# EAGLE schematic RotaryController (EAGLE 7.5.0)
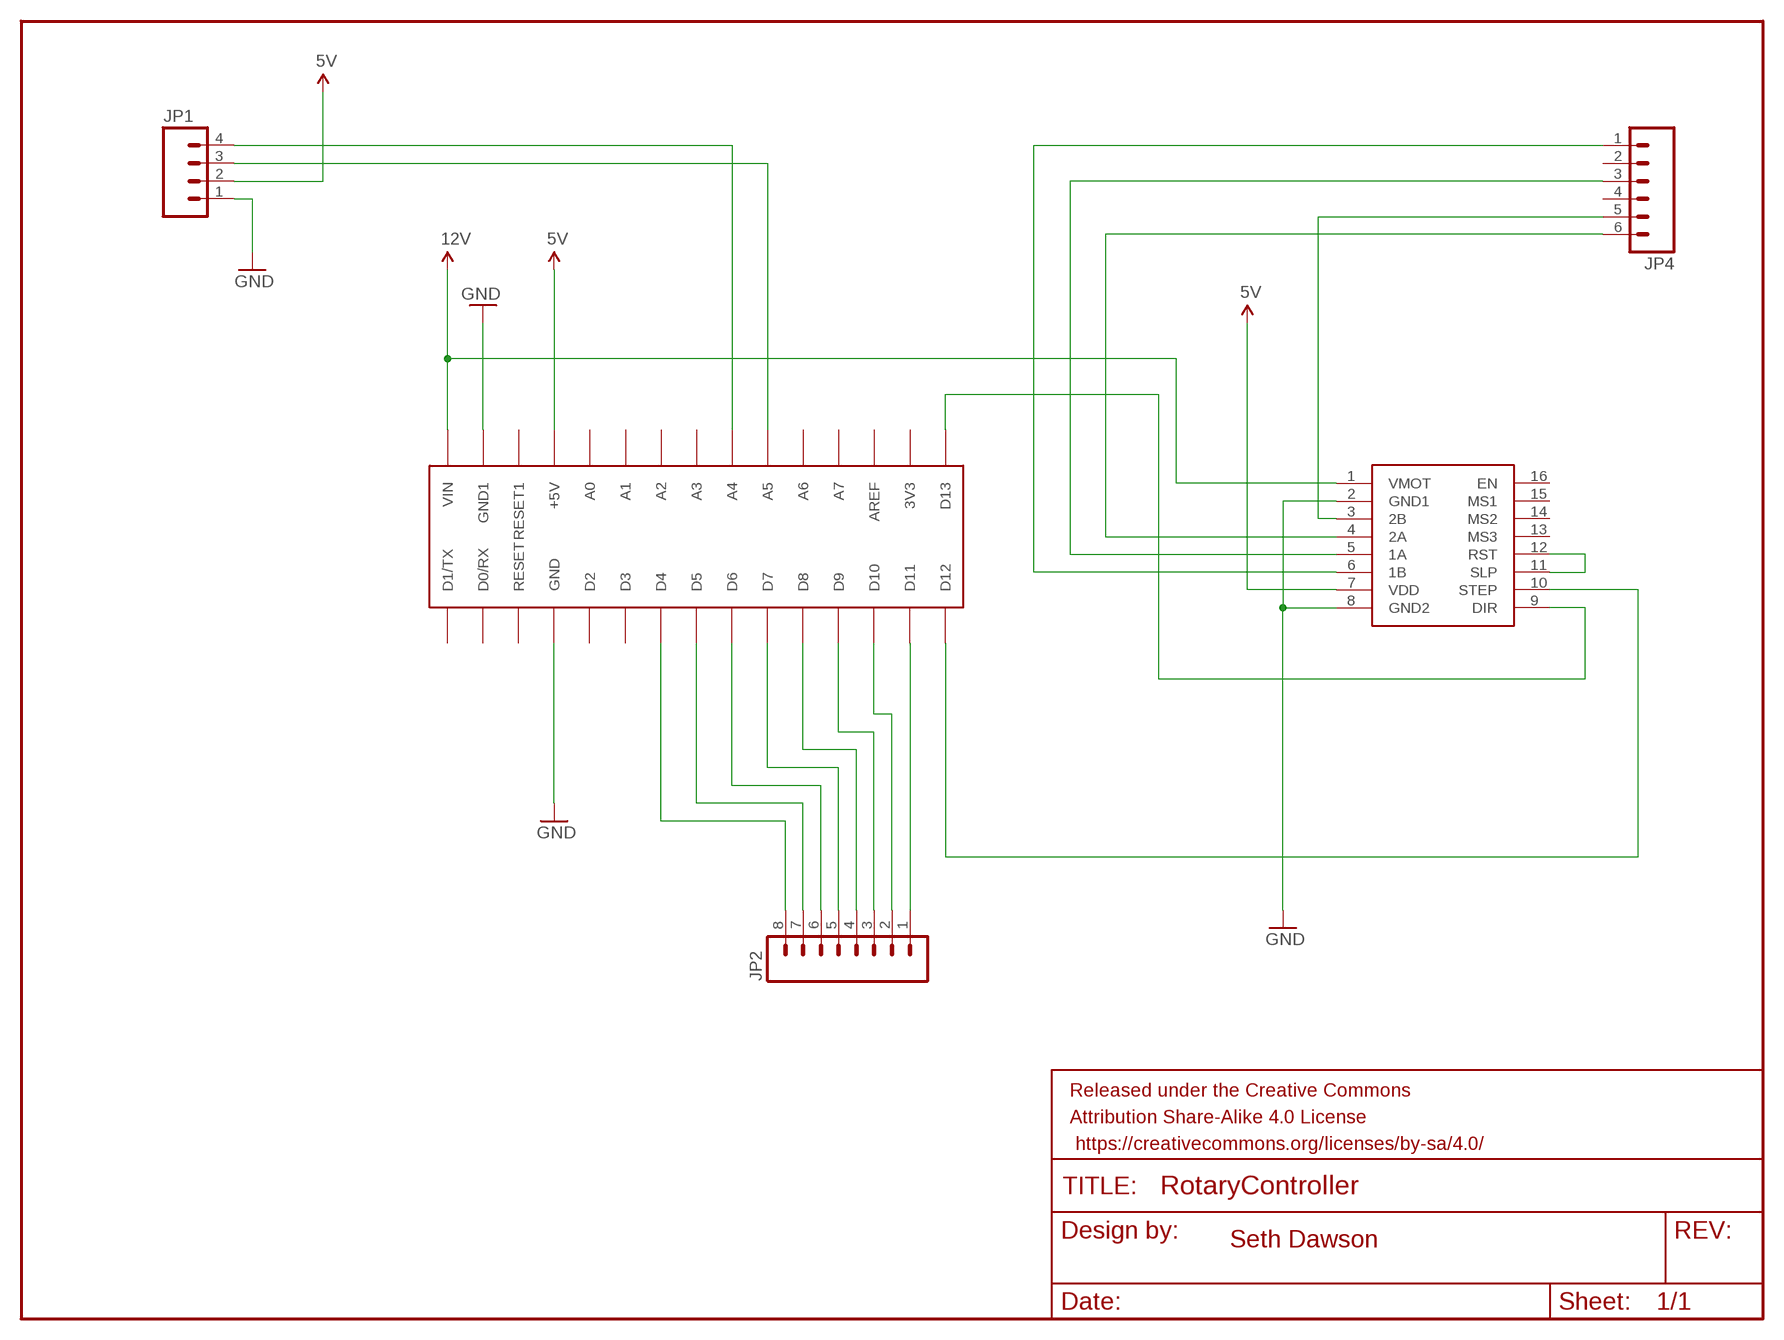
[diagram p0: schematic, sheet 1]

## Parts
FRAME1  FRAME-LETTER  [CREATIVE_COMMONS]
JP1  M04LOCK  [1X04_LOCK]
JP2  M08  [1X08_ROUND]
JP4  M06LOCK  [1X06_LOCK]
U$1  ARDUINONANO  [PDIP-32]
U$2  POLOLUESTEPPERDRIVER  [DIL16]

## Nets
5V: JP1.2 U$1.+5V U$2.7(VDD)
12V: U$1.VIN U$2.1(VMOT)
GND: JP1.1 U$1.GND U$1.GND1 U$2.2(GND1) U$2.8(GND2)
LCD-SCL: JP1.4 U$1.A4
LCD-SDA: JP1.3 U$1.A5
N$1: U$1.D12 U$2.10(STEP)
N$2: U$1.D13 U$2.9(DIR)
N$3: U$2.11(SLP) U$2.12(RST)
N$4: JP2.8 U$1.D4
N$5: JP2.1 U$1.D11
N$6: JP2.7 U$1.D5
N$7: JP2.6 U$1.D6
N$8: JP2.5 U$1.D7
N$9: JP2.4 U$1.D8
N$10: JP2.3 U$1.D9
N$11: JP2.2 U$1.D10
N$12: JP4.1 U$2.6(1B)
N$13: JP4.3 U$2.5(1A)
N$14: JP4.6 U$2.4(2A)
N$15: JP4.5 U$2.3(2B)
Unconnected: JP4.2 JP4.4 U$1.3V3 U$1.A0 U$1.A1 U$1.A2 U$1.A3 U$1.A6 U$1.A7 U$1.AREF U$1.D0/RX U$1.D1/TX U$1.D2 U$1.D3 U$1.RESET U$1.RESET1 U$2.13(MS3) U$2.14(MS2) U$2.15(MS1) U$2.16(EN)

## Notes on the sheet
- Seth Dawson

## Library data of the parts
FRAME1 = SparkFun-Aesthetics:FRAME-LETTER: Schematic Frame Standard 8.5x11 US Letter frame
JP1 = SparkFun-Connectors:M04: Header 4 Standard 4-pin 0.1" header. Use with straight break away headers (SKU : PRT-00116), right angle break away headers (PRT-00553), swiss pins (PRT-00743), machine pins (PRT-00117), and female headers (PRT-00115). Molex polarized connector foot print use with SKU : PRT-08231 with associated crimp pins and housings. 1MM SMD Version SKU: PRT-10208
JP2 = SparkFun-Connectors:M08: Header 8 Standard 8-pin 0.1" header. Use with straight break away headers (SKU : PRT-00116), right angle break away headers (PRT-00553), swiss pins (PRT-00743), machine pins (PRT-00117), and female headers (PRT-00115).
JP4 = SparkFun-Connectors:M06: Header 6 Standard 6-pin 0.1" header. Use with straight break away headers (SKU : PRT-00116), right angle break away headers (PRT-00553), swiss pins (PRT-00743), machine pins (PRT-00117), and female headers (PRT-00115). Molex polarized connector foot print use with SKU : PRT-08094 with associated crimp pins and housings. NOTES ON THE VARIANTS LOCK and LOCK_LONGPADS... This footprint was designed to help hold the alignment of a through-hole component (i.e. 6-pin header) while soldering it into place. You may notice that each hole has been shifted either up or down by 0.005 of an inch from it's more standard position (which is a perfectly straight line). This slight alteration caused the pins (the squares in the middle) to touch the edges of the holes. Because they are alternating, it causes a "brace" to hold the component in place. 0.005 has proven to be the perfect amount of "off-center" position when using our standard breakaway headers. Although looks a little odd when you look at the bare footprint, once you have a header in there, the alteration is very hard to notice. Also,if you push a header all the way into place, it is covered up entirely on the bottom side. This idea of altering the position of holes to aid alignment will be further integrated into the Sparkfun Library for other footprints. It can help hold any component with 3 or more connection pins.
U$1 = jet-lib:ARDUINONANO
U$2 = reprap:POLOLUESTEPPERDRIVER: Pololu stepper driver based on the A4983.